# Altium project PCB_Project.PrjPcb
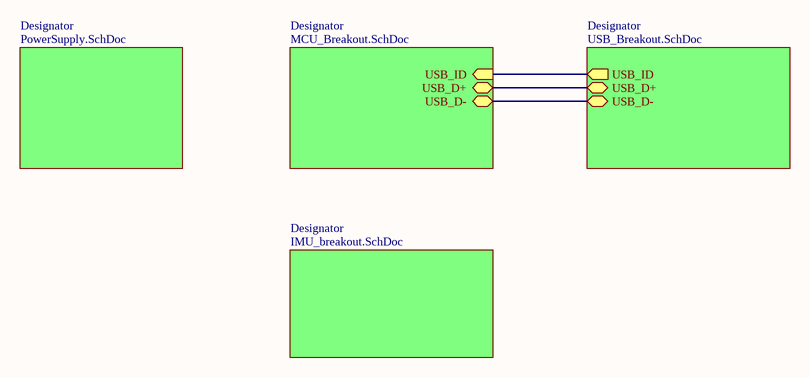
[diagram p0: MCU_Top.SchDoc]
5 sheets, 23 parts. Net scope: hierarchical (ports join the sheet entries above them; power ports are global).
Board file: MicrocontrollerBrd.PcbDoc
Sheets:
  MCU_Top.SchDoc
    Designator = MCU_Breakout.SchDoc
    Designator = USB_Breakout.SchDoc
    Designator = IMU_breakout.SchDoc
    Designator = PowerSupply.SchDoc

## Sheet MCU_Top.SchDoc
size A4

### Sub-sheets
Designator = MCU_Breakout.SchDoc: USB_ID (in), USB_D+ (bidir), USB_D- (bidir)
Designator = USB_Breakout.SchDoc: USB_ID (out), USB_D+ (bidir), USB_D- (bidir)
Designator = IMU_breakout.SchDoc: no entries
Designator = PowerSupply.SchDoc: no entries

### Nets
NetJ?_2: sheet Designator/USB_D-, sheet Designator/USB_D-
NetJ?_3: sheet Designator/USB_D+, sheet Designator/USB_D+
NetJ?_4: sheet Designator/USB_ID, sheet Designator/USB_ID

## Sheet MCU_Breakout.SchDoc
size A1
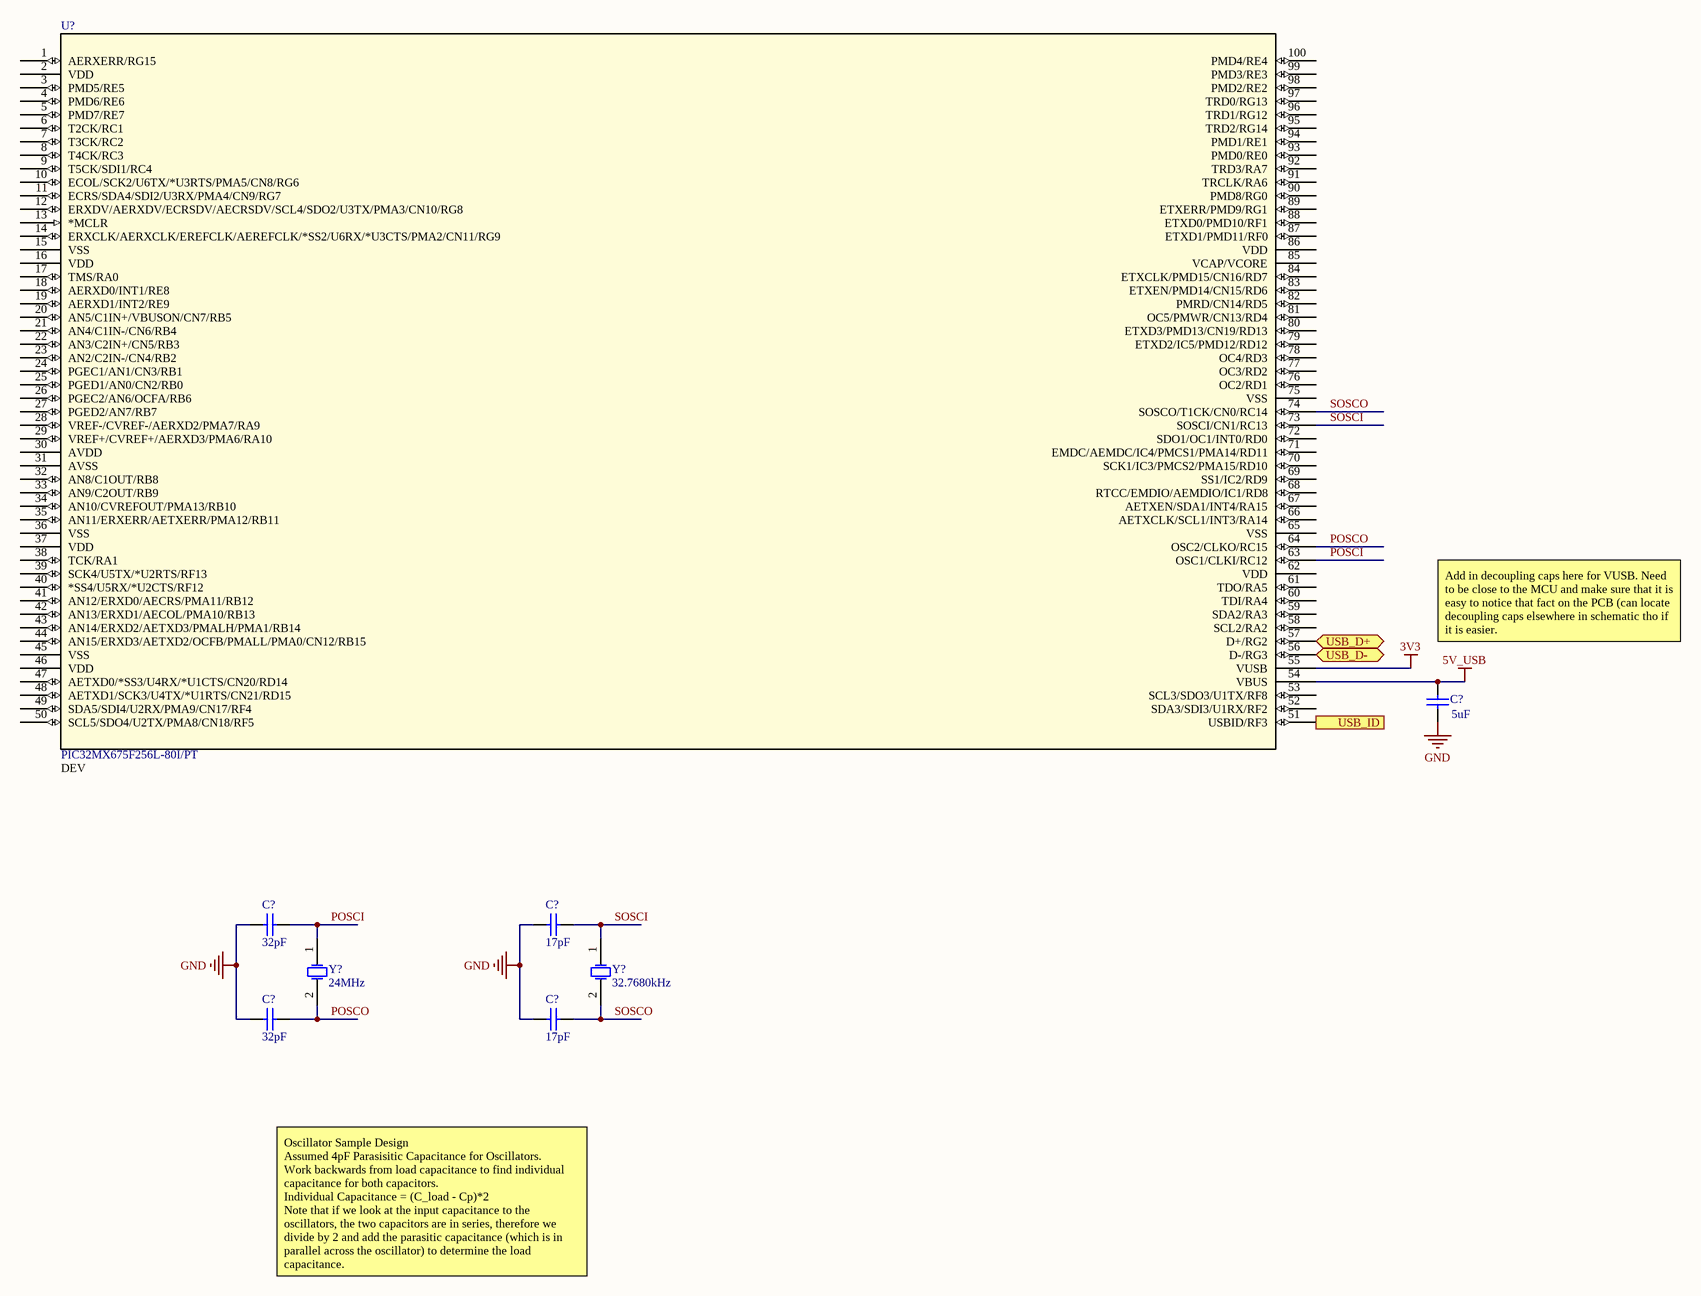
[diagram p1: MCU_Breakout.SchDoc]

### Parts
(Parts that share a designator on the sheet are numbered #1, #2 ... from top to bottom, then left to right.)
C?#1  value 5uF  [RAD-0.3]  (hidden comment: Cap)
C?#2  value 32pF  [RAD-0.3]  (hidden comment: Cap)
C?#3  value 17pF  [RAD-0.3]  (hidden comment: Cap)
C?#4  value 32pF  [RAD-0.3]  (hidden comment: Cap)
C?#5  value 17pF  [RAD-0.3]  (hidden comment: Cap)
U?#1  PIC32MX675F256L-80I/PT  Type: DEV  [TQFP100_12x12MC_MCH]
Y?#1  24MHz
Y?#2  32.7680kHz

### Ports
USB_D+ (bidir), USB_D- (bidir), USB_ID (in)

### Nets
3V3: U?#1.55(VUSB)
5V_USB: C?#1.2 U?#1.54(VBUS)
GND: C?#1.1 C?#2.2 C?#3.2 C?#4.2 C?#5.2
POSCI: C?#2.1 U?#1.63(OSC1/CLKI/RC12) Y?#1.1(OSC1)
POSCO: C?#4.1 U?#1.64(OSC2/CLKO/RC15) Y?#1.2(OSC2)
SOSCI: C?#3.1 U?#1.73(SOSCI/CN1/RC13) Y?#2.1(OSC1)
SOSCO: C?#5.1 U?#1.74(SOSCO/T1CK/CN0/RC14) Y?#2.2(OSC2)
NetJ?_2: U?#1.56(D-/RG3) ; port USB_D-
NetJ?_3: U?#1.57(D+/RG2) ; port USB_D+
NetJ?_4: U?#1.51(USBID/RF3) ; port USB_ID

Not connected (* = marked no-connect by the designer): U?#1 1(AERXERR/RG15) 2(VDD) 3(PMD5/RE5) 4(PMD6/RE6) 5(PMD7/RE7) 6(T2CK/RC1) 7(T3CK/RC2) 8(T4CK/RC3) 9(T5CK/SDI1/RC4) 10(ECOL/SCK2/U6TX/*U3RTS/PMA5/CN8/RG6) 11(ECRS/SDA4/SDI2/U3RX/PMA4/CN9/RG7) 12(ERXDV/AERXDV/ECRSDV/AECRSDV/SCL4/SDO2/U3TX/PMA3/CN10/RG8) 13(*MCLR) 14(ERXCLK/AERXCLK/EREFCLK/AEREFCLK/*SS2/U6RX/*U3CTS/PMA2/CN11/RG9) 15(VSS) 16(VDD) 17(TMS/RA0) 18(AERXD0/INT1/RE8) 19(AERXD1/INT2/RE9) 20(AN5/C1IN+/VBUSON/CN7/RB5) 21(AN4/C1IN-/CN6/RB4) 22(AN3/C2IN+/CN5/RB3) 23(AN2/C2IN-/CN4/RB2) 24(PGEC1/AN1/CN3/RB1) 25(PGED1/AN0/CN2/RB0) 26(PGEC2/AN6/OCFA/RB6) 27(PGED2/AN7/RB7) 28(VREF-/CVREF-/AERXD2/PMA7/RA9) 29(VREF+/CVREF+/AERXD3/PMA6/RA10) 30(AVDD) 31(AVSS) 32(AN8/C1OUT/RB8) 33(AN9/C2OUT/RB9) 34(AN10/CVREFOUT/PMA13/RB10) 35(AN11/ERXERR/AETXERR/PMA12/RB11) 36(VSS) 37(VDD) 38(TCK/RA1) 39(SCK4/U5TX/*U2RTS/RF13) 40(*SS4/U5RX/*U2CTS/RF12) 41(AN12/ERXD0/AECRS/PMA11/RB12) 42(AN13/ERXD1/AECOL/PMA10/RB13) 43(AN14/ERXD2/AETXD3/PMALH/PMA1/RB14) 44(AN15/ERXD3/AETXD2/OCFB/PMALL/PMA0/CN12/RB15) 45(VSS) 46(VDD) 47(AETXD0/*SS3/U4RX/*U1CTS/CN20/RD14) 48(AETXD1/SCK3/U4TX/*U1RTS/CN21/RD15) 49(SDA5/SDI4/U2RX/PMA9/CN17/RF4) 50(SCL5/SDO4/U2TX/PMA8/CN18/RF5) 52(SDA3/SDI3/U1RX/RF2) 53(SCL3/SDO3/U1TX/RF8) 58(SCL2/RA2) 59(SDA2/RA3) 60(TDI/RA4) 61(TDO/RA5) 62(VDD) 65(VSS) 66(AETXCLK/SCL1/INT3/RA14) 67(AETXEN/SDA1/INT4/RA15) 68(RTCC/EMDIO/AEMDIO/IC1/RD8) 69(SS1/IC2/RD9) 70(SCK1/IC3/PMCS2/PMA15/RD10) 71(EMDC/AEMDC/IC4/PMCS1/PMA14/RD11) 72(SDO1/OC1/INT0/RD0) 75(VSS) 76(OC2/RD1) 77(OC3/RD2) 78(OC4/RD3) 79(ETXD2/IC5/PMD12/RD12) 80(ETXD3/PMD13/CN19/RD13) 81(OC5/PMWR/CN13/RD4) 82(PMRD/CN14/RD5) 83(ETXEN/PMD14/CN15/RD6) 84(ETXCLK/PMD15/CN16/RD7) 85(VCAP/VCORE) 86(VDD) 87(ETXD1/PMD11/RF0) 88(ETXD0/PMD10/RF1) 89(ETXERR/PMD9/RG1) 90(PMD8/RG0) 91(TRCLK/RA6) 92(TRD3/RA7) 93(PMD0/RE0) 94(PMD1/RE1) 95(TRD2/RG14) 96(TRD1/RG12) 97(TRD0/RG13) 98(PMD2/RE2) 99(PMD3/RE3) 100(PMD4/RE4)

### Notes on the sheet
- Add in decoupling caps here for VUSB. Need to be close to the MCU and make sure that it is easy to notice that fact on the PCB (can locate decoupling caps elsewhere in schematic tho if it is easier.
- Oscillator Sample Design
  Assumed 4pF Parasisitic Capacitance for Oscillators.
  Work backwards from load capacitance to find individual capacitance for both capacitors.
  Individual Capacitance = (C_load - Cp)*2
  Note that if we look at the input capacitance to the oscillators, the two capacitors are in series, therefore we divide by 2 and add the parasitic capacitance (which is in parallel across the oscillator) to determine the load capacitance.

### Library data of the parts
C?#1-C?#5 = Cap: Capacitor; Published: 8-Jun-2000; LatestRevisionDate: 17-Jul-2002; LatestRevisionNote: Re-released for DXP Platform.; PackageReference: RAD-0.3; Publisher: Altium Limited; PackageDescription: Radial Cap, Thru-Hole; 2 Leads; 0.3 in Pin Spacing
U?#1 = PIC32MX675F256L-80I/PT: MIPS32® M4K™ series Microcontroller IC 32-Bit 80MHz 256KB (256K x 8) FLASH 100-TQFP (12x12); Vendor: Microchip; Built_By: EMA_UL_Team; SourceLibrary: Microchip_2011-05-13; Manufacturer_Part_Number: PIC32MX675F256L-80I/PT; Copyright: Copyright (C) 2021 Accelerated Designs. All rights reserved; RefDes: RefDes; ComponentLink1Description: DigiKey Link; ComponentLink1URL: https://www.digikey.ca/en/products/detail/microchip-technology/PIC32MX675F256L-80I-PT/2184466
Y?#1 = Crystal 24MHz: 24 MHz ±50ppm Crystal 20pF 30 Ohms HC-49/US THRU; Published: 8-Jun-2000; LatestRevisionDate: 17-Jul-2002; LatestRevisionNote: Re-released for DXP Platform.; PackageReference: R38; Publisher: Altium Limited; PackageDescription: Crystal, Thru-Hole; 2 Leads; Body 3.1 x 8.2 mm (Dia.xH)
Y?#2 = Crystal 32.7680kHz: 32.768 kHz ±20ppm Crystal 12.5pF 35 kOhms Cylindrical Can, Radial THRU; Published: 8-Jun-2000; LatestRevisionDate: 17-Jul-2002; LatestRevisionNote: Re-released for DXP Platform.; PackageReference: R38; Publisher: Altium Limited; PackageDescription: Crystal, Thru-Hole; 2 Leads; Body 3.1 x 8.2 mm (Dia.xH)

## Sheet USB_Breakout.SchDoc
size A4
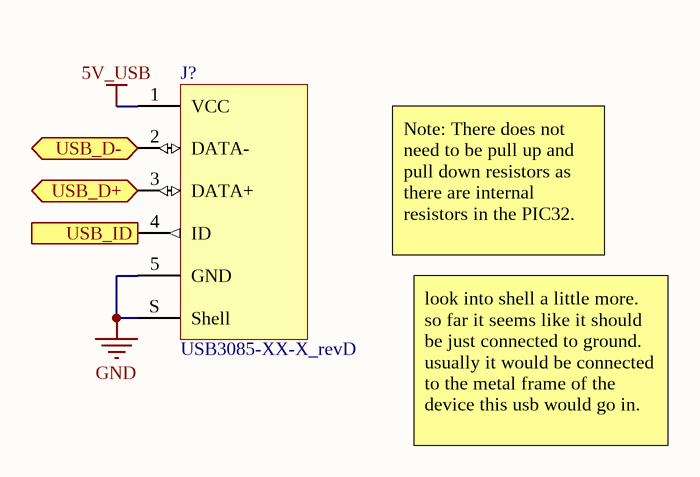
[diagram p2: USB_Breakout.SchDoc]

### Parts
J?  USB3085-XX-X_revD  [USB3085-XX-X_revD]

### Ports
USB_D+ (bidir), USB_D- (bidir), USB_ID (out)

### Nets
5V_USB: J?.1(VCC)
GND: J?.5(GND) J?.S(Shell)
NetJ?_2: J?.2(DATA-) ; port USB_D-
NetJ?_3: J?.3(DATA+) ; port USB_D+
NetJ?_4: J?.4(ID) ; port USB_ID

### Notes on the sheet
- Note: There does not need to be pull up and pull down resistors as there are internal resistors in the PIC32.
- look into shell a little more. so far it seems like it should be just connected to ground. usually it would be connected to the metal frame of the device this usb would go in.

### Library data of the parts
J? = USB3085-XX-X_revD: Micro USB Receptacle, Type AB, SMT, Horizontal, Bottom Mount, without Peg

## Sheet IMU_breakout.SchDoc
size A4
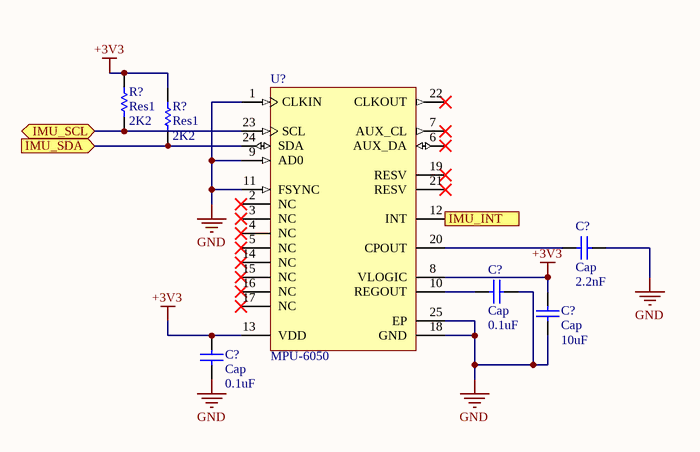
[diagram p3: IMU_breakout.SchDoc]

### Parts
(Parts that share a designator on the sheet are numbered #1, #2 ... from top to bottom, then left to right.)
C?#6  Cap  value 2.2nF  [RAD-0.3]
C?#7  Cap  value 0.1uF  [RAD-0.3]
C?#8  Cap  value 10uF  [RAD-0.3]
C?#9  Cap  value 0.1uF  [RAD-0.3]
R?#1  Res1  value 2K2  [AXIAL-0.3]
R?#2  Res1  value 2K2  [AXIAL-0.3]
U?#2  MPU-6050  [IS-QFN-24_V]

### Ports
IMU_INT (out), IMU_SCL (bidir), IMU_SDA (in)

### Nets
+3V3: C?#8.2 C?#9.2 R?#1.2 R?#2.2 U?#2.8(VLOGIC) U?#2.13(VDD)
GND: C?#6.1 C?#7.1 C?#8.1 C?#9.1 U?#2.1(CLKIN) U?#2.9(AD0) U?#2.11(FSYNC) U?#2.18(GND) U?#2.25(EP)
NetC?#6_2: C?#6.2 U?#2.20(CPOUT)
NetC?#7_2: C?#7.2 U?#2.10(REGOUT)
NetR?#1_1: R?#1.1 U?#2.23(SCL) ; port IMU_SCL
NetR?#2_1: R?#2.1 U?#2.24(SDA) ; port IMU_SDA
NetU?#2_12: U?#2.12(INT) ; port IMU_INT

Not connected (* = marked no-connect by the designer): U?#2 2(NC)* 3(NC)* 4(NC)* 5(NC)* 6(AUX_DA)* 7(AUX_CL)* 14(NC)* 15(NC)* 16(NC)* 17(NC)* 19(RESV)* 21(RESV)* 22(CLKOUT)*

### Library data of the parts
C?#6-C?#9 = Cap: Capacitor; Published: 8-Jun-2000; LatestRevisionDate: 17-Jul-2002; LatestRevisionNote: Re-released for DXP Platform.; PackageReference: RAD-0.3; Publisher: Altium Limited; PackageDescription: Radial Cap, Thru-Hole; 2 Leads; 0.3 in Pin Spacing
R?#1 R?#2 = Res1: Resistor; Published: 8-Jun-2000; LatestRevisionDate: 17-Jul-2002; LatestRevisionNote: Re-released for DXP Platform.; PackageReference: AXIAL-0.3; Publisher: Altium Limited; PackageDescription: Axial Device, Thru-Hole; 2 Leads; 0.3 in Pin Spacing
U?#2 = CMP-1753-00002-2: 3-Axis Gyroscope, Accelerometer and a Digital Motion Processor(TM) (DMP), 2.375 to 3.46 V, -40 to 85 degC, 24-Pin QFN, RoHS, Tape and Reel; Manufacturer: InvenSense; Featured Product: MPU-60506-Axis,IntegratedI²CSolution; Other Names: 1428-1007-2 / MPU6050; Sensor Type: MotionTracking; Online Catalog: MPU-6000™Series; Unit PriceUSD: Digital; Datasheet Version: Rev. 3.3, 05/2012; Category: Sensors,Transducers; Datasheet URL: http://datasheet.octopart.com/MPU-6050-InvenSense-datasheet-14421344.pdf; Family: Multifunction; Standard Package: 5,000; Manufacturer URL: http://www.invensense.com/; Output Type: Digital; Dynamic Catalog: MPU-6000™Series

## Sheet PowerSupply.SchDoc
size A4
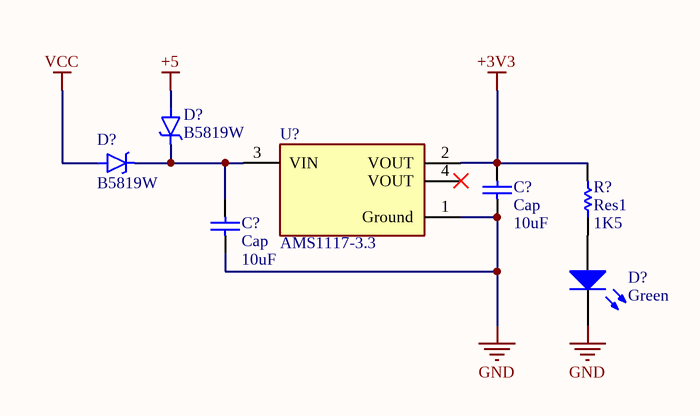
[diagram p4: PowerSupply.SchDoc]

### Parts
(Parts that share a designator on the sheet are numbered #1, #2 ... from top to bottom, then left to right.)
C?#10  Cap  value 10uF  [RAD-0.3]
C?#11  Cap  value 10uF  [RAD-0.3]
D?#1  B5819W  [SOD-123]
D?#2  B5819W  [SOD-123]
D?#3  Green  [3.2X1.6X1.1]
R?#3  Res1  value 1K5  [AXIAL-0.3]
U?#3  AMS1117-3.3  [FP-AMS1117-IPC_C]

### Nets
+3V3: C?#10.2 R?#3.2 U?#3.2(VOUT)
+5: D?#1.A
GND: C?#10.1 C?#11.1 D?#3.2(K) U?#3.1(Ground)
VCC: D?#2.A
NetC?#11_2: C?#11.2 D?#1.C D?#2.C U?#3.3(VIN)
NetD?#3_1: D?#3.1(A) R?#3.1

Not connected (* = marked no-connect by the designer): U?#3 4(VOUT)*

### Library data of the parts
C?#10 C?#11 = Cap: Capacitor; Published: 8-Jun-2000; LatestRevisionDate: 17-Jul-2002; LatestRevisionNote: Re-released for DXP Platform.; PackageReference: RAD-0.3; Publisher: Altium Limited; PackageDescription: Radial Cap, Thru-Hole; 2 Leads; 0.3 in Pin Spacing
D?#1 D?#2 = B5819W: Schottky Diode; MF: Taiwan Semiconductor; SnapEDA_Link: https://www.snapeda.com/parts/B5819W/Taiwan%20Semiconductor/view-part/105688/?ref=snap; MP: B5819W; Availability: Unavailable; Price: None; Value: *; Package: SOD-123 Taiwan Semiconductor
D?#3 = LED2: Typical RED, GREEN, YELLOW, AMBER GaAs LED; Published: 8-Jun-2000; LatestRevisionDate: 17-Jul-2002; LatestRevisionNote: Re-released for DXP Platform.; PackageVersion: Feb-2002; PackageReference: 3.2X1.6X1.1; Publisher: Altium Limited; PackageDescription: SM LED; 2 Flat Leads
R?#3 = Res1: Resistor; Published: 8-Jun-2000; LatestRevisionDate: 17-Jul-2002; LatestRevisionNote: Re-released for DXP Platform.; PackageReference: AXIAL-0.3; Publisher: Altium Limited; PackageDescription: Axial Device, Thru-Hole; 2 Leads; 0.3 in Pin Spacing
U?#3 = CMP-209535-000001-1: LDO Voltage Regulators 1A, 3.3V; Manufacturer: Advanced Monolithic Systems; Dropout Voltage: 1.1V; Output Type: Fixed; Nominal Supply Current: 5mA; Max Power Dissipation: 1.2W; Max Supply Voltage: 15V; Number Of Outputs: 1; Standoff Height: 0.64mm; Max Junction Temp: +125°C; Height: 1.8mm; Package: AMS1117; Device Class L2: Power Management ICs; ComponentLink2Description: Datasheet; ComponentLink2URL: http://www.advanced-monolithic.com/pdf/ds1117.pdf; Category: IC; RoHS: TRUE; Automotive: No; Device Class L1: Integrated Circuits (ICs); Output Current: 1A; Device Class L3: Voltage Regulators - Linear; Temperature: -40°C to +125°C; Output Voltage: 3.3V; Manufacturer Part Number: AMS1117-3.3; Temperature Range Low: -40°C; Octopart: https://octopart.com/ams1117-3.3-advanced+monolithic+systems-25899300; Lead Free: Yes; Ipc Land Pattern Name: SOT229P700X180-4; Temperature Range High: +125°C

## Nets that join several sheets
5V_USB: MCU_Breakout (C?#1.2 U?#1.54), USB_Breakout (J?.1)
+3V3: IMU_breakout (6 pins), PowerSupply (C?#10.2 R?#3.2 U?#3.2)
GND: MCU_Breakout (5 pins), USB_Breakout (J?.5 J?.S), IMU_breakout (9 pins), PowerSupply (C?#10.1 C?#11.1 D?#3.2 U?#3.1)
NetJ?_2: MCU_Breakout (U?#1.56), USB_Breakout (J?.2)
NetJ?_3: MCU_Breakout (U?#1.57), USB_Breakout (J?.3)
NetJ?_4: MCU_Breakout (U?#1.51), USB_Breakout (J?.4)